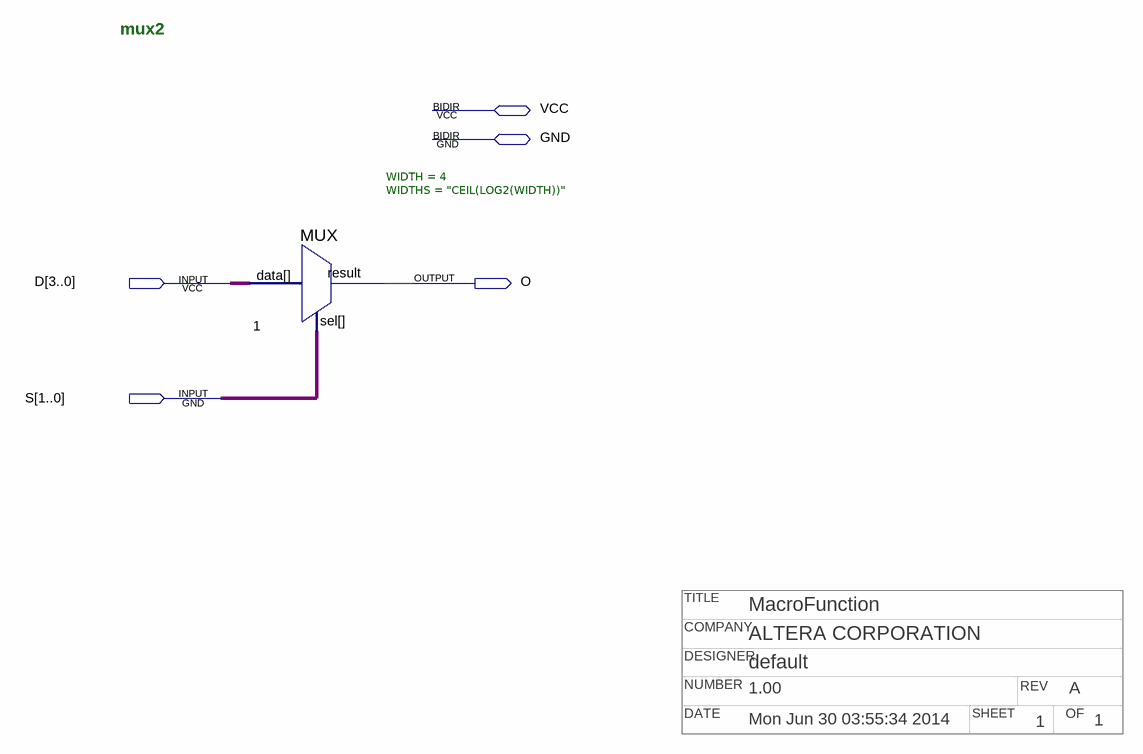
[diagram p0: schematic sheet]
// Quartus schematic npmux4.bdf as structural Verilog: 1 symbols, 5 pins
// Title block: TITLE: MacroFunction; COMPANY: ALTERA CORPORATION; DESIGNER: default; NUMBER: 1.00; REV: A; DATE: Mon Jun 30 03:55:34 2014; SHEET: 1; OF: 1
module npmux4 (
  input  [3:0] D,
  input  [1:0] S,
  inout  VCC,
  inout  GND,
  output O
);

  MUX #(.WIDTH(4), .WIDTHS("CEIL(LOG2(WIDTH))")) u_1 (.data(D), .sel(S), .result(O));

  // Notes on the sheet:
  //   mux2
endmodule
